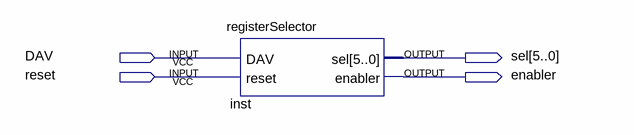
[diagram p0: schematic sheet]
// Quartus schematic testregisterselector.bdf as structural Verilog: 1 symbols, 4 pins
module testregisterselector (
  input  DAV,
  input  reset,
  output [5:0] sel,
  output enabler
);

  registerSelector inst (.DAV(DAV), .reset(reset), .sel(sel), .enabler(enabler));
endmodule
